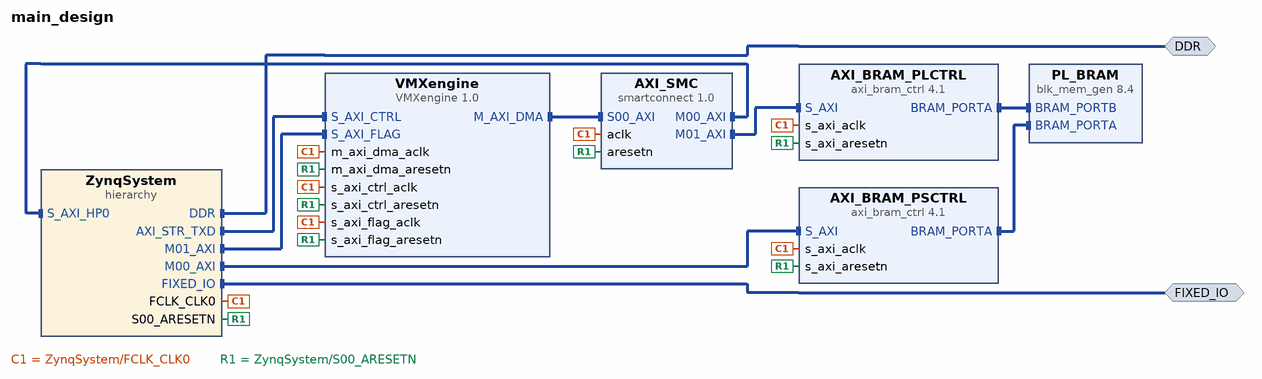
[diagram p0: block diagram of the top level]
# Vivado block design main_design, xc7z020clg484-1, Vivado 2019.2
create_bd_design main_design

create_bd_intf_port -mode Master -vlnv xilinx.com:interface:ddrx_rtl:1.0 DDR
create_bd_intf_port -mode Master -vlnv xilinx.com:display_processing_system7:fixedio_rtl:1.0 FIXED_IO

create_bd_cell -type hier ZynqSystem
create_bd_cell -type ip -vlnv nctu.edu.tw:user:VMXengine:1.0 VMXengine
create_bd_cell -type ip -vlnv xilinx.com:ip:axi_bram_ctrl:4.1 AXI_BRAM_PSCTRL
set_property -dict {CONFIG.SINGLE_PORT_BRAM 1} [get_bd_cells AXI_BRAM_PSCTRL]
create_bd_cell -type ip -vlnv xilinx.com:ip:axi_bram_ctrl:4.1 AXI_BRAM_PLCTRL
set_property -dict {CONFIG.SINGLE_PORT_BRAM 1} [get_bd_cells AXI_BRAM_PLCTRL]
create_bd_cell -type ip -vlnv xilinx.com:ip:blk_mem_gen:8.4 PL_BRAM
set_property -dict [list \
  CONFIG.Enable_B Use_ENB_Pin \
  CONFIG.Memory_Type True_Dual_Port_RAM \
  CONFIG.Port_B_Clock 100 \
  CONFIG.Port_B_Enable_Rate 100 \
  CONFIG.Port_B_Write_Rate 50 \
  CONFIG.Use_RSTB_Pin true \
] [get_bd_cells PL_BRAM]
create_bd_cell -type ip -vlnv xilinx.com:ip:smartconnect:1.0 AXI_SMC
set_property -dict {CONFIG.NUM_MI 2 CONFIG.NUM_SI 1} [get_bd_cells AXI_SMC]

# ---- hierarchy /ZynqSystem ----
current_bd_instance /ZynqSystem
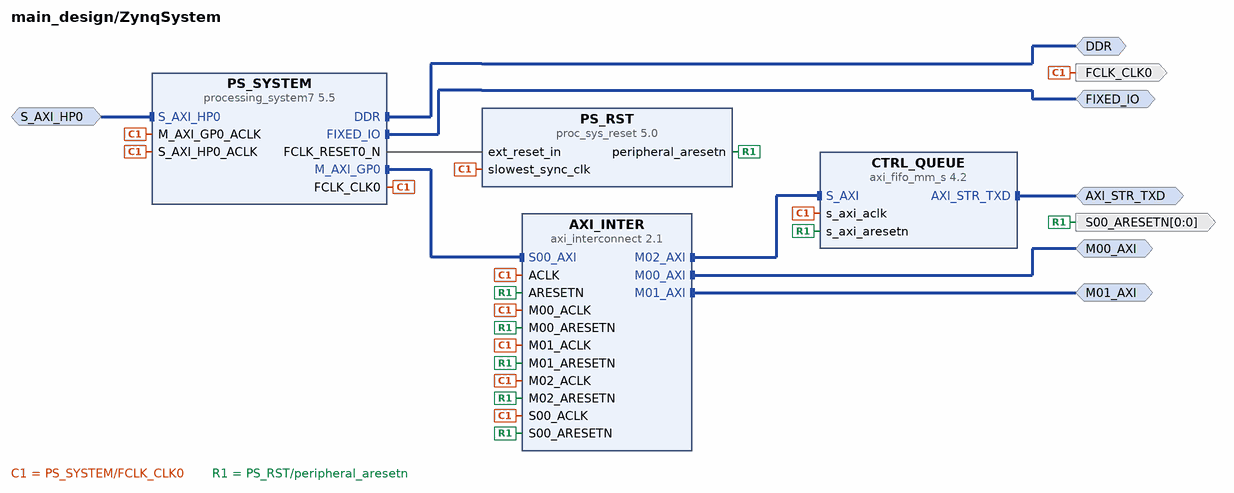
[diagram p1: block diagram inside /ZynqSystem]
create_bd_intf_pin -mode Master -vlnv xilinx.com:interface:ddrx_rtl:1.0 DDR
create_bd_intf_pin -mode Master -vlnv xilinx.com:display_processing_system7:fixedio_rtl:1.0 FIXED_IO
create_bd_intf_pin -mode Slave -vlnv xilinx.com:interface:aximm_rtl:1.0 S_AXI_HP0
create_bd_intf_pin -mode Master -vlnv xilinx.com:interface:axis_rtl:1.0 AXI_STR_TXD
create_bd_intf_pin -mode Master -vlnv xilinx.com:interface:aximm_rtl:1.0 M00_AXI
create_bd_intf_pin -mode Master -vlnv xilinx.com:interface:aximm_rtl:1.0 M01_AXI
create_bd_pin -dir O -type clk FCLK_CLK0
create_bd_pin -dir O -from 0 -to 0 -type rst S00_ARESETN

create_bd_cell -type ip -vlnv xilinx.com:ip:proc_sys_reset:5.0 PS_RST
create_bd_cell -type ip -vlnv xilinx.com:ip:processing_system7:5.5 PS_SYSTEM
set_property -dict [list \
  CONFIG.PCW_APU_PERIPHERAL_FREQMHZ 666.666666 \
  CONFIG.PCW_CAN0_CAN0_IO {MIO 46 .. 47} \
  CONFIG.PCW_CAN0_PERIPHERAL_ENABLE 1 \
  CONFIG.PCW_CAN_PERIPHERAL_FREQMHZ 23.8095 \
  CONFIG.PCW_ENET0_ENET0_IO {MIO 16 .. 27} \
  CONFIG.PCW_ENET0_GRP_MDIO_ENABLE 1 \
  CONFIG.PCW_ENET0_GRP_MDIO_IO {MIO 52 .. 53} \
  CONFIG.PCW_ENET0_PERIPHERAL_ENABLE 1 \
  CONFIG.PCW_ENET0_PERIPHERAL_FREQMHZ {100 Mbps} \
  CONFIG.PCW_ENET0_RESET_ENABLE 1 \
  CONFIG.PCW_ENET0_RESET_IO {MIO 11} \
  CONFIG.PCW_ENET_RESET_ENABLE 1 \
  CONFIG.PCW_ENET_RESET_SELECT {Share reset pin} \
  CONFIG.PCW_FPGA0_PERIPHERAL_FREQMHZ 200 \
  CONFIG.PCW_GPIO_MIO_GPIO_ENABLE 1 \
  CONFIG.PCW_GPIO_MIO_GPIO_IO MIO \
  CONFIG.PCW_I2C0_GRP_INT_ENABLE 0 \
  CONFIG.PCW_I2C0_I2C0_IO {MIO 50 .. 51} \
  CONFIG.PCW_I2C0_PERIPHERAL_ENABLE 1 \
  CONFIG.PCW_I2C0_RESET_ENABLE 1 \
  CONFIG.PCW_I2C0_RESET_IO {MIO 13} \
  CONFIG.PCW_I2C_PERIPHERAL_FREQMHZ 111.111115 \
  CONFIG.PCW_I2C_RESET_ENABLE 1 \
  CONFIG.PCW_I2C_RESET_SELECT {Share reset pin} \
  CONFIG.PCW_PRESET_BANK0_VOLTAGE {LVCMOS 1.8V} \
  CONFIG.PCW_PRESET_BANK1_VOLTAGE {LVCMOS 1.8V} \
  CONFIG.PCW_QSPI_GRP_FBCLK_ENABLE 1 \
  CONFIG.PCW_QSPI_GRP_FBCLK_IO {MIO 8} \
  CONFIG.PCW_QSPI_GRP_SINGLE_SS_ENABLE 1 \
  CONFIG.PCW_QSPI_GRP_SINGLE_SS_IO {MIO 1 .. 6} \
  CONFIG.PCW_QSPI_PERIPHERAL_ENABLE 1 \
  CONFIG.PCW_QSPI_QSPI_IO {MIO 1 .. 6} \
  CONFIG.PCW_SD0_GRP_CD_ENABLE 1 \
  CONFIG.PCW_SD0_GRP_CD_IO {MIO 0} \
  CONFIG.PCW_SD0_GRP_WP_ENABLE 1 \
  CONFIG.PCW_SD0_GRP_WP_IO {MIO 15} \
  CONFIG.PCW_SD0_PERIPHERAL_ENABLE 1 \
  CONFIG.PCW_SD0_SD0_IO {MIO 40 .. 45} \
  CONFIG.PCW_SDIO_PERIPHERAL_FREQMHZ 50 \
  CONFIG.PCW_SINGLE_QSPI_DATA_MODE x4 \
  CONFIG.PCW_TTC0_PERIPHERAL_ENABLE 1 \
  CONFIG.PCW_TTC0_TTC0_IO EMIO \
  CONFIG.PCW_UART1_PERIPHERAL_ENABLE 1 \
  CONFIG.PCW_UART1_UART1_IO {MIO 48 .. 49} \
  CONFIG.PCW_UART_PERIPHERAL_FREQMHZ 50 \
  CONFIG.PCW_UIPARAM_DDR_FREQ_MHZ 533.333333 \
  CONFIG.PCW_UIPARAM_DDR_PARTNO {MT41J256M8 HX-15E} \
  CONFIG.PCW_USB0_PERIPHERAL_ENABLE 1 \
  CONFIG.PCW_USB0_RESET_ENABLE 1 \
  CONFIG.PCW_USB0_RESET_IO {MIO 7} \
  CONFIG.PCW_USB0_USB0_IO {MIO 28 .. 39} \
  CONFIG.PCW_USB_RESET_ENABLE 1 \
  CONFIG.PCW_USB_RESET_SELECT {Share reset pin} \
  CONFIG.PCW_USE_S_AXI_HP0 1 \
  CONFIG.preset ZC702 \
] [get_bd_cells PS_SYSTEM]
# 223 more settings of PS_SYSTEM are not shown: defaults, MIO pin electricals, DDR timing, and values the tool derives
create_bd_cell -type ip -vlnv xilinx.com:ip:axi_fifo_mm_s:4.2 CTRL_QUEUE
set_property -dict [list \
  CONFIG.C_DATA_INTERFACE_TYPE 0 \
  CONFIG.C_USE_RX_DATA 0 \
  CONFIG.C_USE_TX_CTRL 0 \
  CONFIG.C_USE_TX_CUT_THROUGH 0 \
  CONFIG.C_USE_TX_DATA 1 \
] [get_bd_cells CTRL_QUEUE]
create_bd_cell -type ip -vlnv xilinx.com:ip:axi_interconnect:2.1 AXI_INTER
set_property -dict {CONFIG.NUM_MI 3 CONFIG.NUM_SI 1} [get_bd_cells AXI_INTER]

# ---- connections ----

current_bd_instance /ZynqSystem
connect_bd_intf_net -intf_net processing_system7_0_M_AXI_GP0 [get_bd_intf_pins PS_SYSTEM/M_AXI_GP0] [get_bd_intf_pins AXI_INTER/S00_AXI]
connect_bd_intf_net -intf_net axi_interconnect_0_M02_AXI [get_bd_intf_pins AXI_INTER/M02_AXI] [get_bd_intf_pins CTRL_QUEUE/S_AXI]
connect_bd_intf_net -intf_net processing_system7_0_DDR [get_bd_intf_pins DDR] [get_bd_intf_pins PS_SYSTEM/DDR]
connect_bd_intf_net -intf_net processing_system7_0_FIXED_IO [get_bd_intf_pins FIXED_IO] [get_bd_intf_pins PS_SYSTEM/FIXED_IO]
connect_bd_intf_net -intf_net axi_smc_M00_AXI [get_bd_intf_pins S_AXI_HP0] [get_bd_intf_pins PS_SYSTEM/S_AXI_HP0]
connect_bd_intf_net [get_bd_intf_pins M00_AXI] [get_bd_intf_pins AXI_INTER/M00_AXI]
connect_bd_intf_net -intf_net axi_interconnect_0_M01_AXI [get_bd_intf_pins M01_AXI] [get_bd_intf_pins AXI_INTER/M01_AXI]
connect_bd_intf_net -intf_net ZynqSystem_AXI_STR_TXD [get_bd_intf_pins AXI_STR_TXD] [get_bd_intf_pins CTRL_QUEUE/AXI_STR_TXD]
connect_bd_net -net processing_system7_0_FCLK_RESET0_N [get_bd_pins PS_SYSTEM/FCLK_RESET0_N] [get_bd_pins PS_RST/ext_reset_in]
connect_bd_net -net processing_system7_0_FCLK_CLK0 [get_bd_pins PS_SYSTEM/FCLK_CLK0] \
  [get_bd_pins FCLK_CLK0] [get_bd_pins PS_SYSTEM/S_AXI_HP0_ACLK] [get_bd_pins PS_SYSTEM/M_AXI_GP0_ACLK] \
  [get_bd_pins PS_RST/slowest_sync_clk] [get_bd_pins CTRL_QUEUE/s_axi_aclk] [get_bd_pins AXI_INTER/ACLK] \
  [get_bd_pins AXI_INTER/S00_ACLK] [get_bd_pins AXI_INTER/M00_ACLK] [get_bd_pins AXI_INTER/M01_ACLK] \
  [get_bd_pins AXI_INTER/M02_ACLK]
connect_bd_net -net rst_ps7_0_200M_peripheral_aresetn [get_bd_pins PS_RST/peripheral_aresetn] \
  [get_bd_pins S00_ARESETN] [get_bd_pins CTRL_QUEUE/s_axi_aresetn] [get_bd_pins AXI_INTER/ARESETN] \
  [get_bd_pins AXI_INTER/S00_ARESETN] [get_bd_pins AXI_INTER/M00_ARESETN] [get_bd_pins AXI_INTER/M01_ARESETN] \
  [get_bd_pins AXI_INTER/M02_ARESETN]
set_property HDL_ATTRIBUTE.BMM_INFO_PROCESSOR {arm > main_design AXI_BRAM_PSCTRL} [get_bd_cells PS_SYSTEM]
set_property HDL_ATTRIBUTE.KEEP_HIERARCHY yes [get_bd_cells PS_SYSTEM]

current_bd_instance /
connect_bd_intf_net -intf_net processing_system7_0_DDR [get_bd_intf_ports DDR] [get_bd_intf_pins ZynqSystem/DDR]
connect_bd_intf_net [get_bd_intf_pins VMXengine/M_AXI_DMA] [get_bd_intf_pins AXI_SMC/S00_AXI]
connect_bd_intf_net [get_bd_intf_pins VMXengine/S_AXI_CTRL] [get_bd_intf_pins ZynqSystem/AXI_STR_TXD]
connect_bd_intf_net -intf_net processing_system7_0_FIXED_IO [get_bd_intf_ports FIXED_IO] [get_bd_intf_pins ZynqSystem/FIXED_IO]
connect_bd_intf_net [get_bd_intf_pins AXI_SMC/M00_AXI] [get_bd_intf_pins ZynqSystem/S_AXI_HP0]
connect_bd_intf_net -intf_net axi_bram_ctrl_0_BRAM_PORTA [get_bd_intf_pins PL_BRAM/BRAM_PORTA] [get_bd_intf_pins AXI_BRAM_PSCTRL/BRAM_PORTA]
connect_bd_intf_net [get_bd_intf_pins AXI_SMC/M01_AXI] [get_bd_intf_pins AXI_BRAM_PLCTRL/S_AXI]
connect_bd_intf_net -intf_net AXI_INTER_M00_AXI [get_bd_intf_pins ZynqSystem/M00_AXI] [get_bd_intf_pins AXI_BRAM_PSCTRL/S_AXI]
connect_bd_intf_net -intf_net axi_interconnect_0_M01_AXI [get_bd_intf_pins ZynqSystem/M01_AXI] [get_bd_intf_pins VMXengine/S_AXI_FLAG]
connect_bd_intf_net [get_bd_intf_pins AXI_BRAM_PLCTRL/BRAM_PORTA] [get_bd_intf_pins PL_BRAM/BRAM_PORTB]
connect_bd_net -net processing_system7_0_FCLK_CLK0 [get_bd_pins ZynqSystem/FCLK_CLK0] \
  [get_bd_pins VMXengine/s_axi_flag_aclk] [get_bd_pins VMXengine/m_axi_dma_aclk] [get_bd_pins VMXengine/s_axi_ctrl_aclk] \
  [get_bd_pins AXI_BRAM_PSCTRL/s_axi_aclk] [get_bd_pins AXI_BRAM_PLCTRL/s_axi_aclk] [get_bd_pins AXI_SMC/aclk]
connect_bd_net -net rst_ps7_0_200M_peripheral_aresetn [get_bd_pins ZynqSystem/S00_ARESETN] \
  [get_bd_pins VMXengine/s_axi_flag_aresetn] [get_bd_pins VMXengine/m_axi_dma_aresetn] \
  [get_bd_pins VMXengine/s_axi_ctrl_aresetn] [get_bd_pins AXI_BRAM_PSCTRL/s_axi_aresetn] \
  [get_bd_pins AXI_BRAM_PLCTRL/s_axi_aresetn] [get_bd_pins AXI_SMC/aresetn]
set_property HDL_ATTRIBUTE.BMM_INFO_ADDRESS_SPACE {byte  0x40000000 32 > main_design PL_BRAM} [get_bd_cells AXI_BRAM_PSCTRL]
set_property HDL_ATTRIBUTE.KEEP_HIERARCHY yes [get_bd_cells AXI_BRAM_PSCTRL]

# ---- address map ----
assign_bd_address -offset 0x00000000 -range 1G -target_address_space [get_bd_addr_spaces VMXengine/M_AXI_DMA] [get_bd_addr_segs ZynqSystem/PS_SYSTEM/S_AXI_HP0/HP0_DDR_LOWOCM]
assign_bd_address -offset 0x40000000 -range 8K -target_address_space [get_bd_addr_spaces VMXengine/M_AXI_DMA] [get_bd_addr_segs AXI_BRAM_PLCTRL/S_AXI/Mem0]
assign_bd_address -offset 0x40000000 -range 8K -target_address_space [get_bd_addr_spaces ZynqSystem/PS_SYSTEM/Data] [get_bd_addr_segs AXI_BRAM_PSCTRL/S_AXI/Mem0]
assign_bd_address -offset 0x43C00000 -range 64K -target_address_space [get_bd_addr_spaces ZynqSystem/PS_SYSTEM/Data] [get_bd_addr_segs VMXengine/S_AXI_FLAG/S_AXI_FLAG_reg]
assign_bd_address -offset 0x43C10000 -range 64K -target_address_space [get_bd_addr_spaces ZynqSystem/PS_SYSTEM/Data] [get_bd_addr_segs ZynqSystem/CTRL_QUEUE/S_AXI/Mem0]

validate_bd_design
save_bd_design
